# EAGLE design tx_no_transistor_adjustable_charging_current_hotswap (EAGLE 9.6.1)
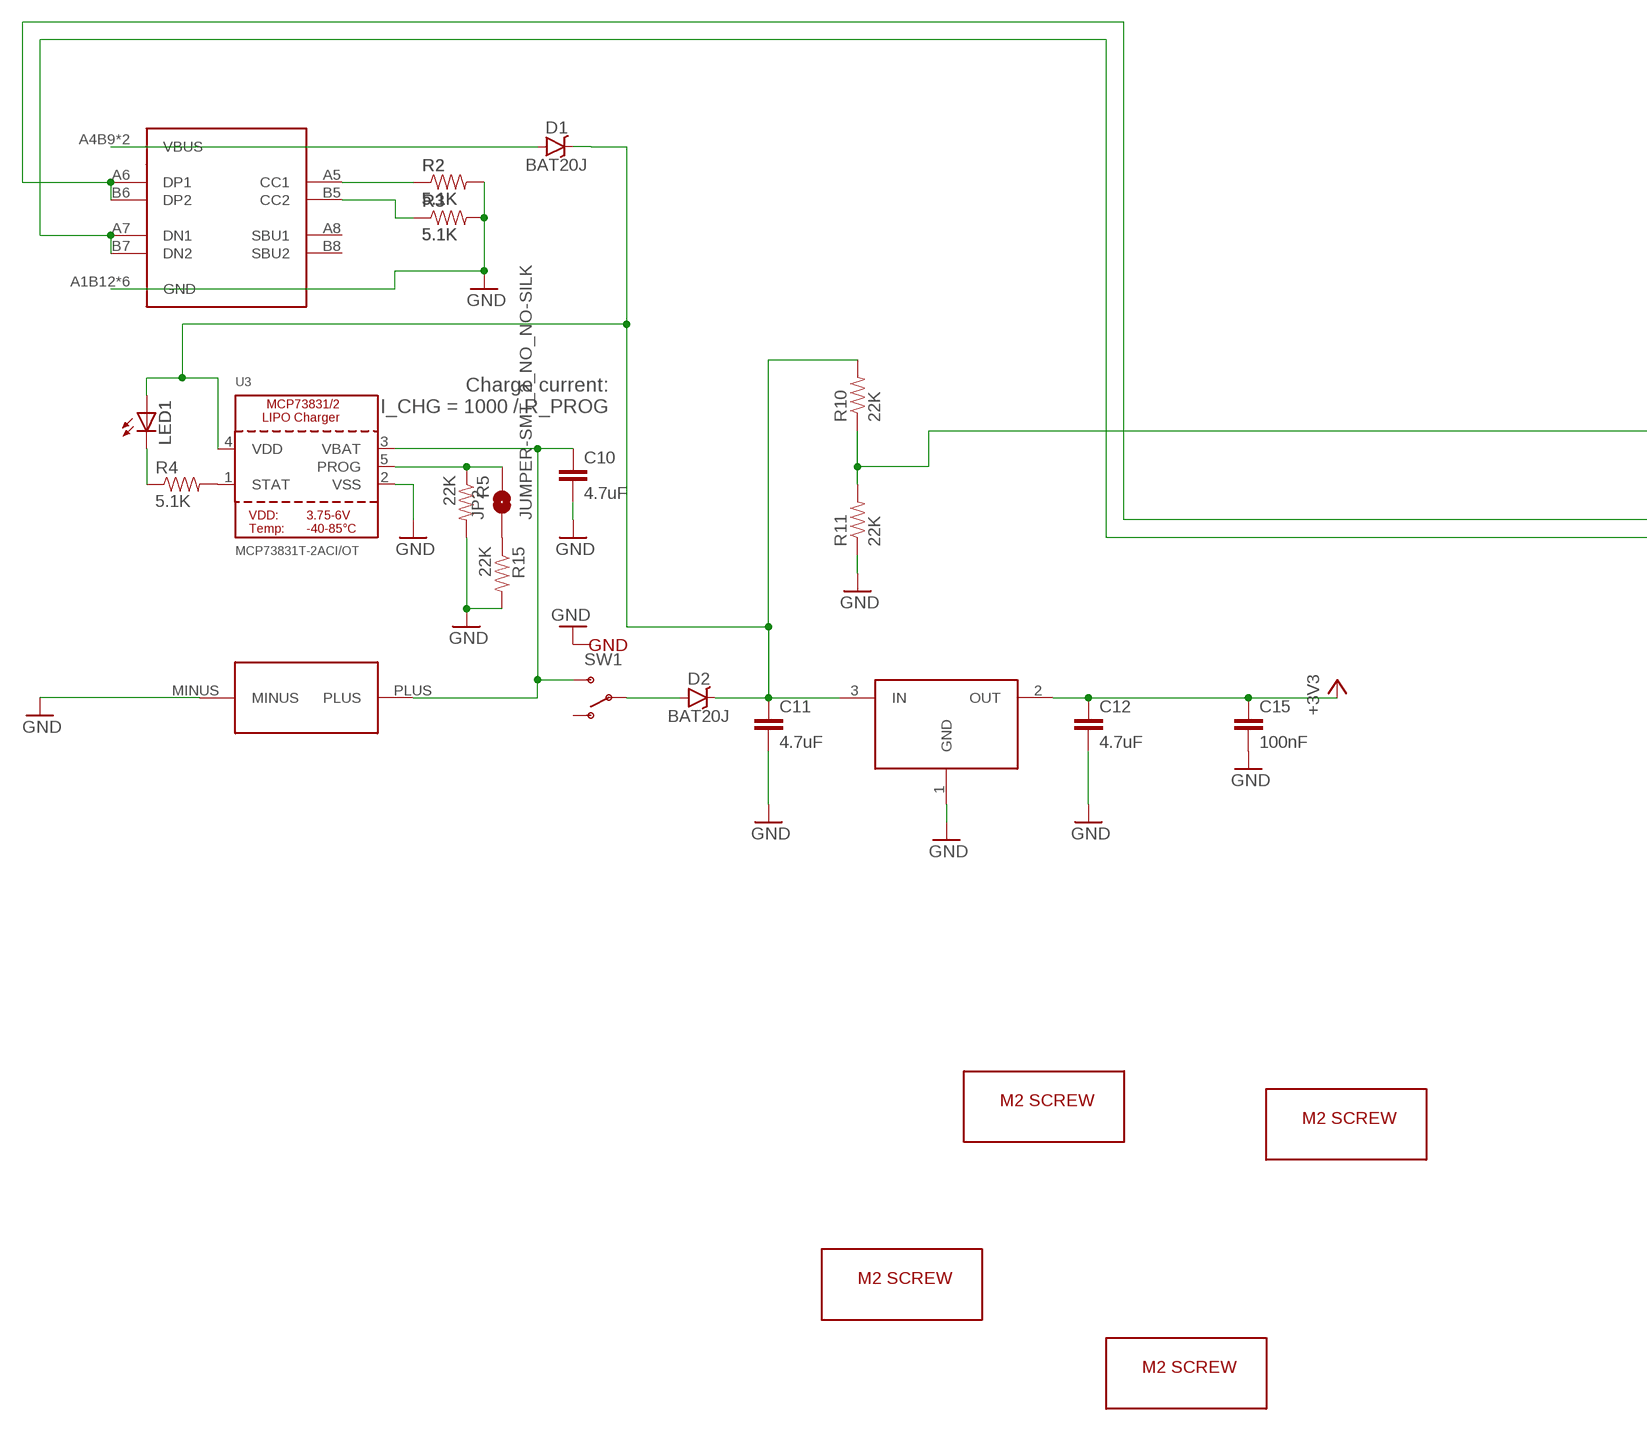
[diagram p0: schematic, sheet 1, part 1 of 2]
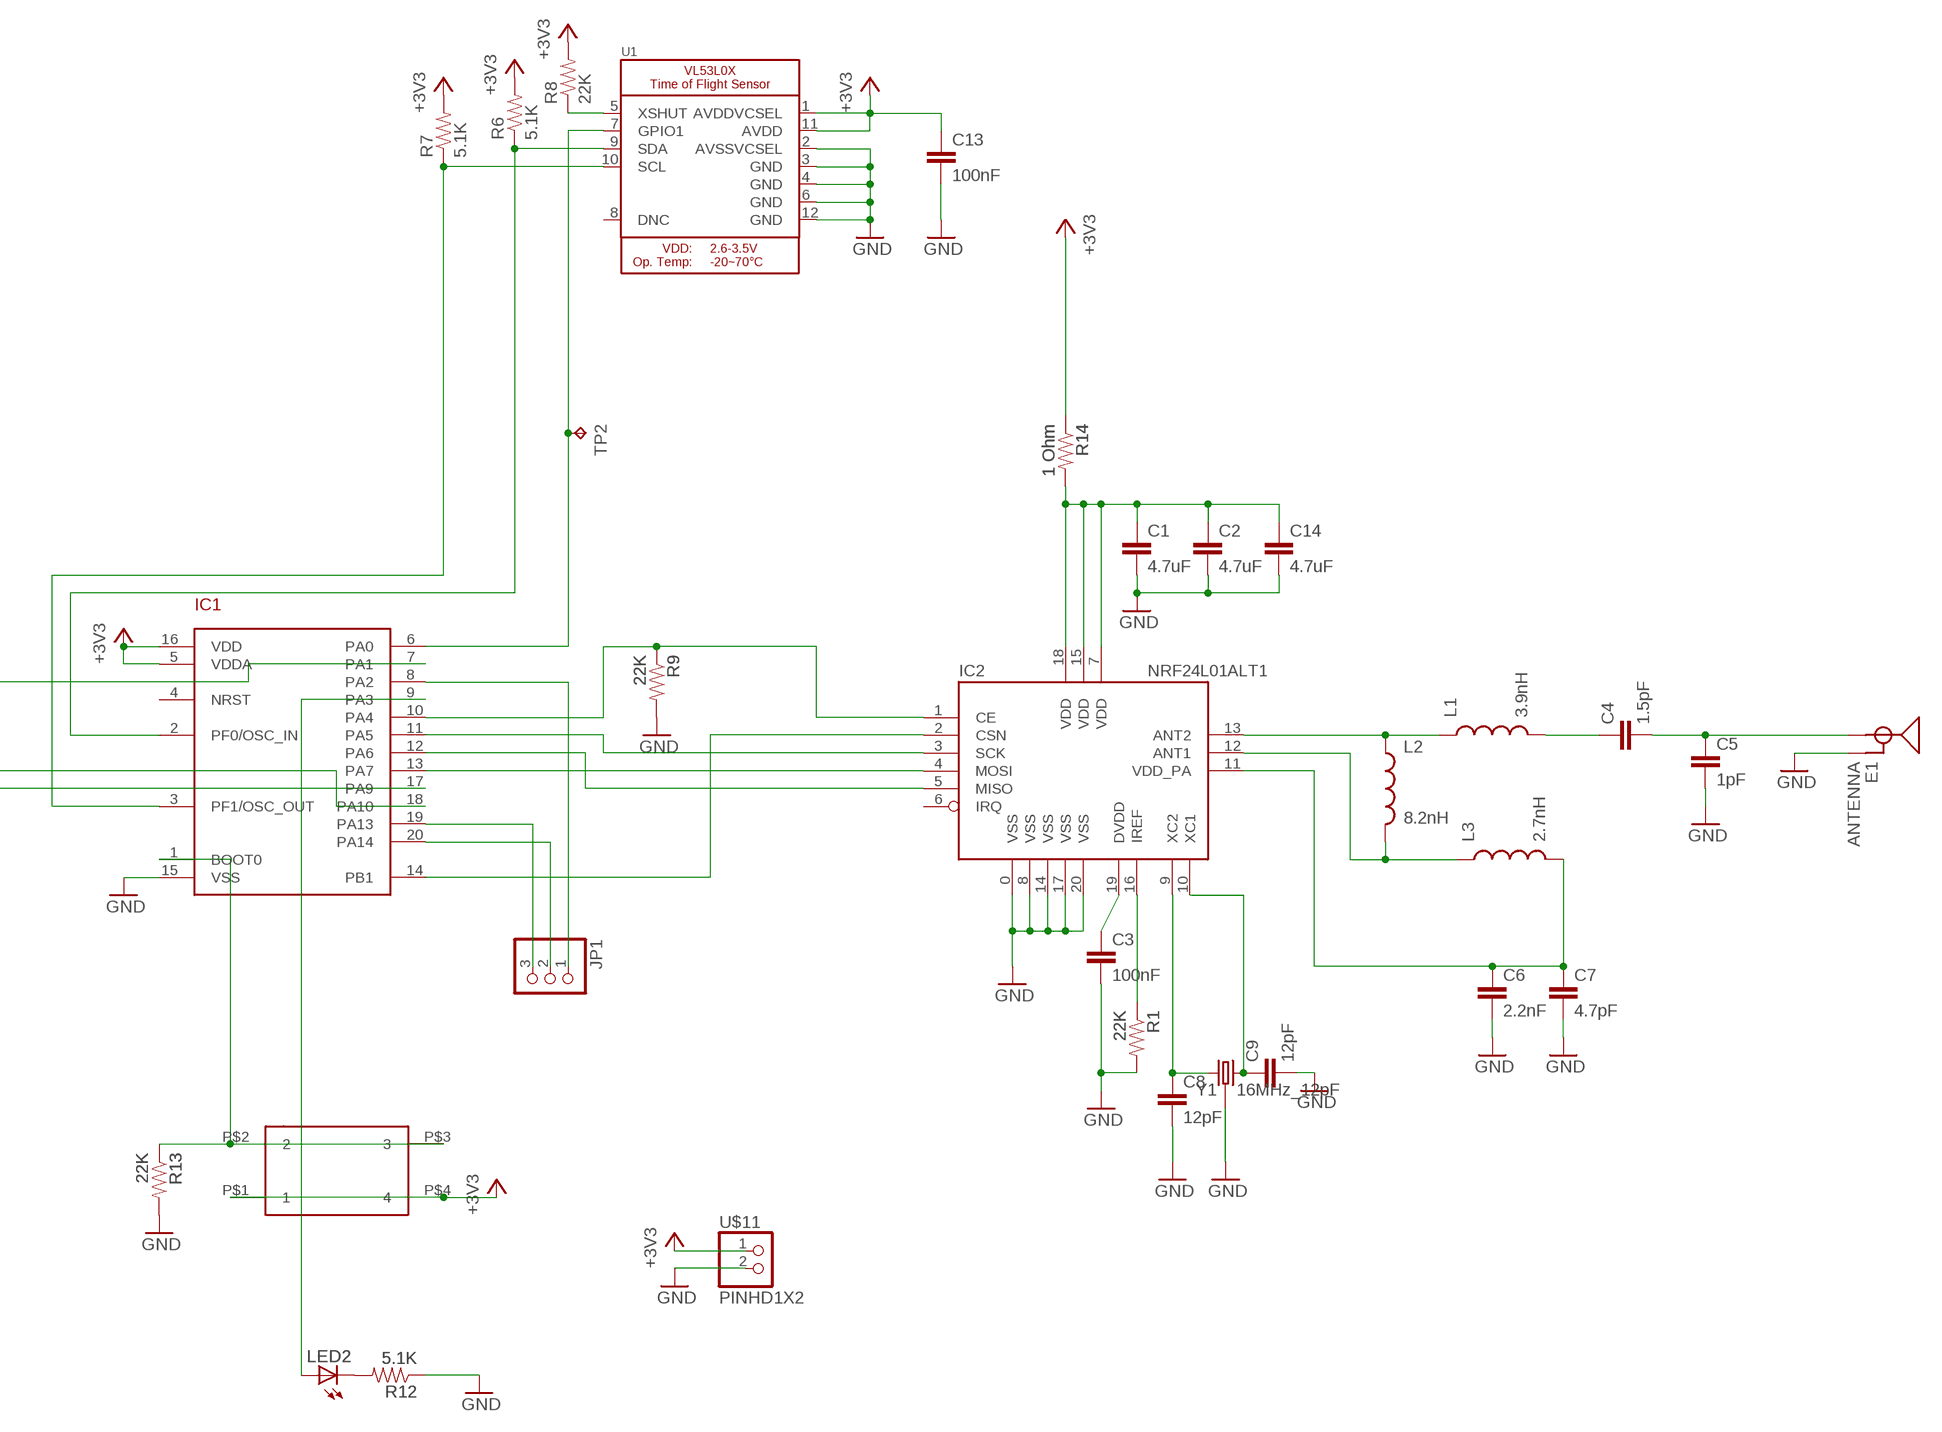
[diagram p1: schematic, sheet 1, part 2 of 2]

## Parts
C1  4.7uF  CAP0805  [0805]
C2  4.7uF  CAP0805  [0805]
C3  100nF  CAP0805  [0805]
C4  1.5pF  CAP0805  [0805]
C5  1pF  CAP0805  [0805]
C6  2.2nF  CAP0805  [0805]
C7  4.7pF  CAP0805  [0805]
C8  12pF  CAP0805  [0805]
C9  12pF  CAP0805  [0805]
C10  4.7uF  CAP0805  [0805]
C11  4.7uF  CAP0805  [0805]
C12  4.7uF  CAP0805  [0805]
C13  100nF  CAP0805  [0805]
C14  4.7uF  CAP0805  [0805]
C15  100nF  CAP0805  [0805]
D1  BAT20J  DIODE-SCHOTTKY-BAT20J  [SOD-323]
D2  BAT20J  DIODE-SCHOTTKY-BAT20J  [SOD-323]
E1  ANTENNA  ANTENNATRACE-TUNED  [TRACE_ANTENNA_2.4GHZ_25.7MM_TUNED]
IC1  STM32F030F4  [TSSOP20]
IC2  NRF24L01ALT1  [QFN20_ALT1]
JP1  PINHD-1X3CB  [1X03-CLEANBIG]
JP2  JUMPER-SMT_2_NO_NO-SILK  [SMT-JUMPER_2_NO_NO-SILK]
L1  3.9nH  INDUCTOR0805  [0805]
L2  8.2nH  INDUCTOR0805  [0805]
L3  2.7nH  INDUCTOR0805  [0805]
LED1  LEDCHIP-LED0805  [CHIP-LED0805]
LED2  LEDCHIP-LED0805  [CHIP-LED0805]
R1  22K  RESISTOR0805-RES  [0805]
R2  5.1K  RESISTOR0805-RES  [0805]
R3  5.1K  RESISTOR0805-RES  [0805]
R4  5.1K  RESISTOR0805-RES  [0805]
R5  22K  RESISTOR0805-RES  [0805]
R6  5.1K  RESISTOR0805-RES  [0805]
R7  5.1K  RESISTOR0805-RES  [0805]
R8  22K  RESISTOR0805-RES  [0805]
R9  22K  RESISTOR0805-RES  [0805]
R10  22K  RESISTOR0805-RES  [0805]
R11  22K  RESISTOR0805-RES  [0805]
R12  5.1K  RESISTOR0805-RES  [0805]
R13  22K  RESISTOR0805-RES  [0805]
R14  1 Ohm  RESISTOR0805-RES  [0805]
R15  22K  RESISTOR0805-RES  [0805]
SW1  SWITCH-SPDTTDFGDFG  [SWITCH-SPST-SMD-A]
SW2  324_SW324_SWITCH_FOOT_HOLE  [342_SWICH_FOOT_HOLE]
TP2  TPTP10R  [TP10R]
U1  VL53L0X  [LGA12_ST]
U2  USBC_16P  [USBC_16P_FOOT]
U3  MCP73831T-2ACI/OT  MCP73831/2  [SOT23-5]
U4  XC6206_DEV  [SOT23R_INFINEON]
U$1  M2_SCREW_DEV  [M2_SCREW_FOOT]
U$2  HOT_SWAP_COIN_BAT  [COIN_BAT_HOTSWAP_SOCKET]
U$11  PINHD1X2  [1X02]
U$12  M2_SCREW_DEV  [M2_SCREW_FOOT]
U$13  M2_SCREW_DEV  [M2_SCREW_FOOT]
U$14  M2_SCREW_DEV  [M2_SCREW_FOOT]
Y1  16MHz_12pF  CRYSTAL-26MHZSMD-3.2X2.5  [CRYSTAL-SMD-3.2X2.5MM]

## Nets
+3V3: C12.1 C13.1 C15.1 IC1.5(VDDA) IC1.16(VDD) R6.2 R7.2 R8.2 R14.1 SW2.P$1 SW2.P$4 U1.1(AVDDVCSEL) U1.11(AVDD) U4.2(OUT) U$11.1
GND: C1.2 C2.2 C3.2 C5.2 C6.2 C7.2 C8.2 C9.2 C10.2 C11.2 C12.2 C13.2 C14.2 C15.2 E1.GND E1.GND2(GND) IC1.15(VSS) IC2.0(VSS) IC2.8(VSS) IC2.14(VSS) IC2.17(VSS) IC2.20(VSS) R1.2 R2.2 R3.2 R5.2 R9.2 R11.1 R12.1 R13.2 R15.2 SW1.G1(GND) SW1.G2(GND) SW1.G3(GND) SW1.G4(GND) U1.2(AVSSVCSEL) U1.3(GND) U1.4(GND) U1.6(GND) U1.12(GND) U2.A1B12(GND) U2.B11A12(GND) U2.P$13(GND) U2.P$14(GND) U2.P$15(GND) U2.P$16(GND) U3.2(VSS) U4.1(GND) U$2.MINUS U$11.2 Y1.2 Y1.4
N$1: C3.1 IC2.19(DVDD)
N$2: IC2.16(IREF) R1.1
N$3: IC2.13(ANT2) L1.1 L2.1
N$4: C4.1 L1.2
N$5: C4.2 C5.1 E1.ANT(SIGNAL)
N$6: IC2.12(ANT1) L2.2 L3.1
N$7: C8.1 IC2.9(XC2) Y1.1
N$8: C6.1 C7.1 IC2.11(VDD_PA) L3.2
N$9: C9.1 IC2.10(XC1) Y1.3
N$10: R3.1 U2.B5(CC2)
N$11: R2.1 U2.A5(CC1)
N$12: LED1.C R4.1
N$13: R4.2 U3.1(STAT)
N$14: IC1.13(PA7) IC2.4(MOSI)
N$15: IC1.12(PA6) IC2.5(MISO)
N$16: IC1.11(PA5) IC2.3(SCK)
N$17: JP2.2 R5.1 U3.5(PROG)
N$18: IC1.18(PA10) U2.A6(DP1) U2.B6(DP2)
N$19: D2.A SW1.2(P)
N$20: IC1.14(PB1) IC2.2(CSN)
N$21: IC1.10(PA4) IC2.1(CE) R9.1
N$22: IC1.3(PF1/OSC_OUT) R7.1 U1.10(SCL)
N$23: IC1.2(PF0/OSC_IN) R6.1 U1.9(SDA)
N$24: R8.1 U1.5(XSHUT)
N$25: C10.1 SW1.3(S) U3.3(VBAT) U$2.PLUS
N$26: D1.A U2.A4B9(VBUS) U2.B4A9(VBUS)
N$27: C11.1 D1.C D2.C LED1.A R10.2 U3.4(VDD) U4.3(IN)
N$28: LED2.C R12.2
N$29: IC1.9(PA3) LED2.A
N$30: IC1.1(BOOT0) R13.1 SW2.P$2 SW2.P$3
N$31: IC1.19(PA13) JP1.3
N$32: IC1.20(PA14) JP1.2
N$33: IC1.8(PA2) JP1.1
N$34: IC1.17(PA9) U2.A7(DN1) U2.B7(DN2)
N$35: IC1.7(PA1) R10.1 R11.2
N$36: IC1.6(PA0) TP2.TP U1.7(GPIO1)
N$37: C1.1 C2.1 C14.1 IC2.7(VDD) IC2.15(VDD) IC2.18(VDD) R14.2
N$38: JP2.1 R15.1
Unconnected: IC1.4(NRST) IC2.6(IRQ) SW1.1(O) U1.8(DNC) U2.A8(SBU1) U2.B8(SBU2)

## Notes on the sheet
- Charge current:
  I_CHG = 1000 / R_PROG

## Library data of the parts
C1-C9 C11-C15 = clock:CAP: Capacitor Standard 0603 ceramic capacitor, and 0.1" leaded capacitor.
C10 = SparkFun-Passives:CAP: Capacitor Standard 0603 ceramic capacitor, and 0.1" leaded capacitor.
D1 D2 = SparkFun-DiscreteSemi:DIODE-SCHOTTKY: Schottky diodes in SFE's production catalog BAT20J 1A 23V 0.62Vf RB751 120mA 40V 0.37Vf PMEG4005EJ 0.5A 40V 0.42Vf MBRA140 1A 40V 0.5Vf B340A 3A 40V SMA; PROD_ID: DIO-11623
E1 = esp32-thing-temp:ANTENNA: Chip antenna Chip antenna with ground or secondary connection. Common with larger metal RF connectors.
IC1 = exixe_pogo:STM32F030F4
IC2 = nRF24L01-Chip-v13:NRF24L01: 2.4GHz Low Power Transceiver This is the very popular, low cost, very low power RF transceiver from Nordic Semiconductor. Simple SPI interface. SKU: COM-00690
JP1 = adafruit_changed:PINHD-1X3: PIN HEADER
JP2 = SparkFun-Jumpers:JUMPER-SMT_2_NO: Normally open jumper This jumper has two pads in close proximity to each other. Apply solder to close the connection. Round pads are easier to solder for beginners, but are a lot larger. SparkFun Product that uses the round pads: SparkFun EL Sequencer <https://www.sparkfun.com/products/12781>
L1-L3 = basicBoard:INDUCTOR: Inductors Basic Inductor/Choke - 0603 and 1206. Footprints are not proven and vary greatly between part numbers. INDUCTOR POWER 3.3UH 4.0A SMD 0.197" L x 0.197" W x 0.177" H (5.00mm x 5.00mm x 4.50mm)
LED1 LED2 = joyAnalog:LED: LED OSRAM: - CHIPLED LG R971, LG N971, LY N971, LG Q971, LY Q971, LO R971, LY R971 LH N974, LH R974 LS Q976, LO Q976, LY Q976 LO Q996 - Hyper CHIPLED LW Q18S LB Q993, LB Q99A, LB R99A - SideLED LS A670, LO A670, LY A670, LG A670, LP A670 LB A673, LV A673, LT A673, LW A673 LH A674 LY A675 LS A676, LA A676, LO A676, LY A676, LW A676 LS A679, LY A679, LG A679 - Hyper Micro SIDELED® LS Y876, LA Y876, LO Y876, LY Y876 LT Y87S - SmartLED LW L88C, LW L88S LB L89C, LB L89S, LG L890 LS L89K, LO L89K, LY L89K LS L896, LA L896, LO L896, LY L896 - TOPLED LS T670, LO T670, LY T670, LG T670, LP T670 LSG T670, LSP T670, LSY T670, LOP T670, LYG T670 LG T671, LOG T671, LSG T671 LB T673, LV T673, LT T673, LW T673 LH T674 LS T676, LA T676, LO T676, LY T676, LB T676, LH T676, LSB T676, LW T676 LB T67C, LV T67C, LT T67C, LS T67K, LO T67K, LY T67K, LW E67C LS E67B, LA E67B, LO E67B, LY E67B, LB E67C, LV E67C, LT E67C LW T67C LS T679, LY T679, LG T679 LS T770, LO T770, LY T770, LG T770, LP T770 LB T773, LV T773, LT T773, LW T773 LH T774 LS E675, LA E675, LY E675, LS T675 LS T776, LA T776, LO T776, LY T776, LB T776 LHGB T686 LT T68C, LB T68C - Hyper Mini TOPLED® LB M676 - Mini TOPLED Santana® LG M470 LS M47K, LO M47K, LY M47K Source: http://www.osram.convergy.de/
R1-R3 R9 R12-R14 = joyAnalog:RESISTOR: Resistor Basic schematic elements and footprints for 0603, 1206, and PTH resistors.
R4-R8 R10 R11 R15 = SparkFun-Passives:RESISTOR: Resistor Basic schematic elements and footprints for 0603, 1206, and PTH resistors.
SW1 = tx:SWITCH-SPDT: SPDT Switch Simple slide switch, Spark Fun Electronics SKU : COM-00102 DPDT SMT slide switch, AYZ0202, SWCH-08179
SW2 = 3pos_slide_switch:324_SW
TP2 = testpad:TP: Test pad
U1 = Adafruit VL53L0X:VL53L0X: VL53L0X - Laser Time of Flight Sensor (2M range)
U2 = my_usbc_16p:USBC_16P
U3 = microbuilder:MCP73831/2: MCP73831/2 LIPO Charger VDD: 3.75 - 6V Temp -40 - 85°C Programmable Charge Rate: 15-500mA NOTE: STAT is a tri-state logic output on the MCP73831 and an open-drain output on the MCP73832. SOT23-5 with 4.2V output and tri-state logic on STAT = MCP73831T-2ACI/OT
U4 = 3pos_slide_switch:XC6206_DEV
U$1 U$12-U$14 = 3pos_slide_switch:M2_SCREW_DEV
U$2 = 3pos_slide_switch_centered:HOT_SWAP_COIN_BAT
U$11 = adafruit_changed:PINHD1X2
Y1 = SparkFun-Clocks:CRYSTAL-26MHZ: 26MHz Crystal w/ Ground Pin Digikey Example <http://www.digikey.com/product-detail/en/epson/TSX-3225%2026.0000MF09Z-AC3/SER3627CT-ND/1802878> Frequency: 26MHz Frequency Stability: ±9ppm Frequency Tolerance: ±10ppm Load Capacitance: 9pF SparkFun Products: SparkFun ESP32 Thing <https://www.sparkfun.com/products/13907> SparkFun ESP8266 Thing Dev Board <https://www.sparkfun.com/products/13711>; PROD_ID: XTAL-12454

## Board
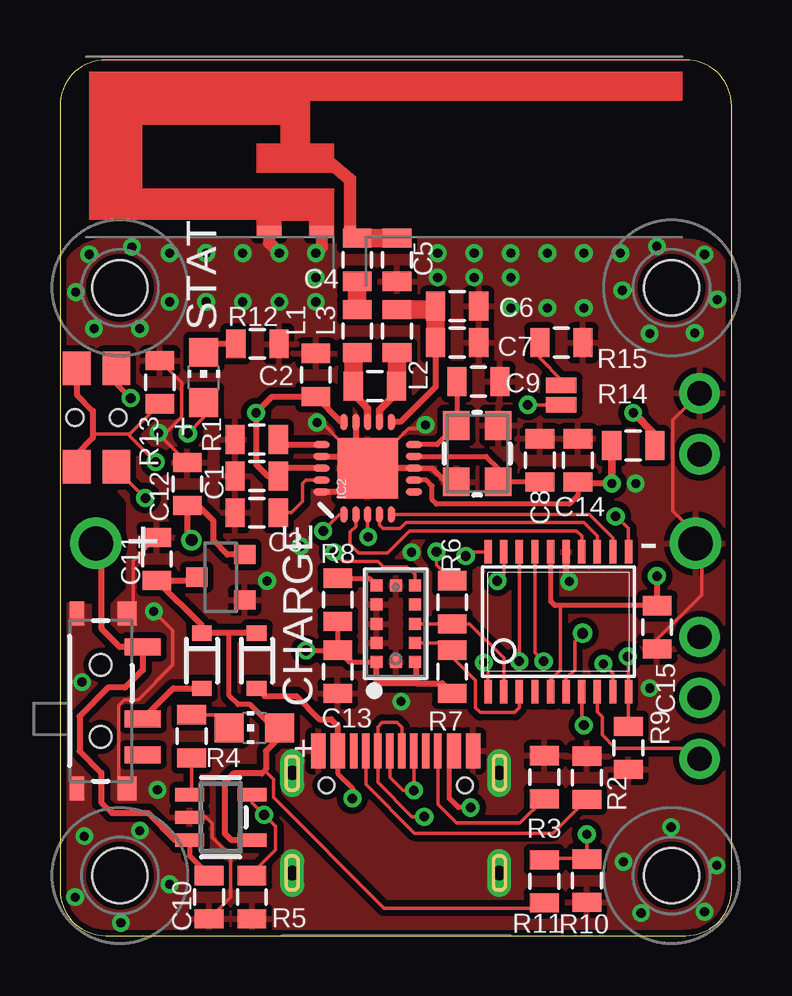
[diagram p2: board, top side]
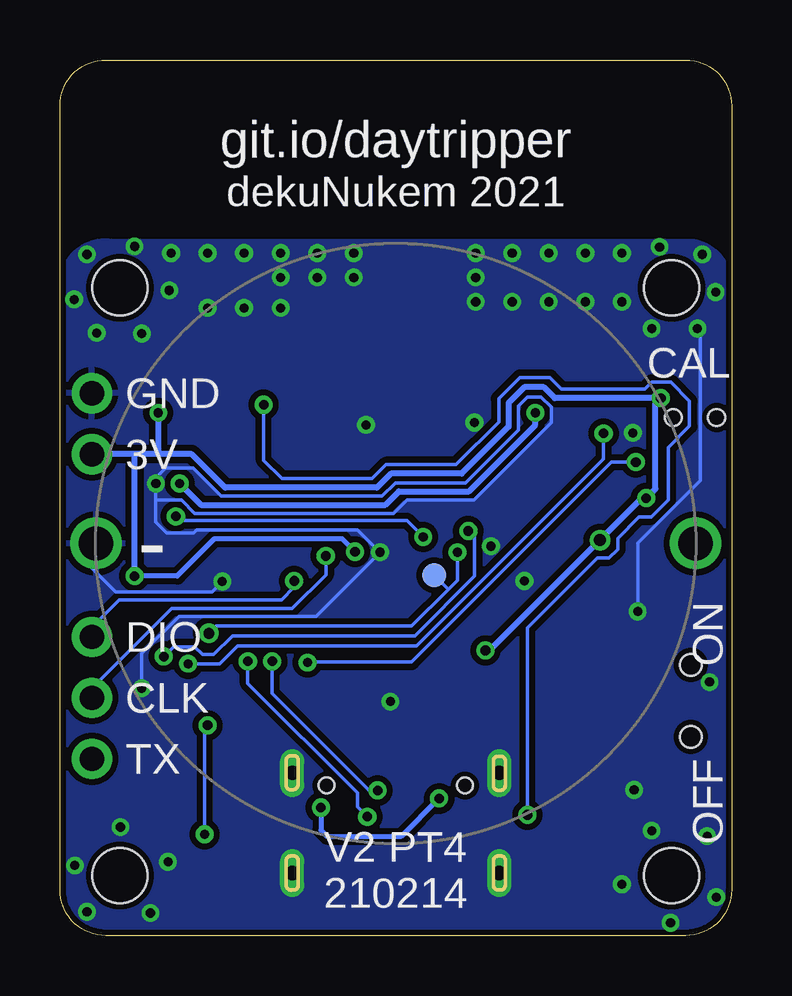
[diagram p3: board, bottom side, seen from below]

Size 28 x 36.5 mm. Coordinates in mm from the lower left corner, seen from the top.
Outline: 0,34.59 0,1.91 arc90 1.91,0 26.09,0 arc90 28,1.91 28,34.59 arc90 26.09,36.5 1.91,36.5 arc90 0,34.59
Copper layers (1*16): Top 0.035mm / dielectric 1.5mm / Bottom 0.035mm
Design rules "SparkFun-2-layer-6mil *": minimum track width 6mil, minimum drill 15mil, track to track 6mil, track to pad 6mil, pad to pad 6mil, via to via 6mil, smd to smd 6mil, copper to edge 8mil, drill to drill 6mil, minimum pad ring 7mil, minimum via ring 7mil, stop-mask expansion 4mil, vias tented up to drill 25mil, thermal gap 10mil
tRestrict: area 0.1,14.1 to 2.4,18.5

### Footprints (pad centres in the part's own frame; a part is rotated, then mirrored left to right if it is on the bottom)
0805 = smd 0.8 x 1.2: 1 -0.9,0; 2 0.9,0
SOD-323 = smd 0.63 x 0.83: A 1.15,0; C -1.15,0
TRACE_ANTENNA_2.4GHZ_25.7MM_TUNED = smd 0.46 x 0.46: ANT 0,0.23 | smd 1 x 0.46: GND -1.18,0.23; GND2 -3.38,0.23
TSSOP20 = smd 0.305 x 0.991: 1 -2.925,-2.918; 2 -2.275,-2.918; 3 -1.625,-2.918; 4 -0.975,-2.918; 5 -0.325,-2.918; 6 0.325,-2.918; 7 0.975,-2.918; 8 1.625,-2.918; 9 2.275,-2.918; 10 2.925,-2.918; 11 2.925,2.918; 12 2.275,2.918; 13 1.625,2.918; 14 0.975,2.918; 15 0.325,2.918; 16 -0.325,2.918; 17 -0.975,2.918; 18 -1.625,2.918; 19 -2.275,2.918; 20 -2.925,2.918
QFN20_ALT1 = smd 2.515 x 2.515: 0 0,0 | smd 0.686 x 0.293: 1 -1.925,0.986; 2 -1.925,0.493; 3 -1.925,0; 4 -1.925,-0.493; 5 -1.925,-0.986; 11 1.925,-0.986; 12 1.925,-0.493; 13 1.925,0; 14 1.925,0.493; 15 1.925,0.986 | smd 0.293 x 0.686: 6 -0.986,-1.925; 7 -0.493,-1.925; 8 0,-1.925; 9 0.493,-1.925; 10 0.986,-1.925; 16 0.986,1.925; 17 0.493,1.925; 18 0,1.925; 19 -0.493,1.925; 20 -0.986,1.925
1X03-CLEANBIG = drill 1.016 pad 1.676: 1 -2.54,0; 2 0,0; 3 2.54,0
SMT-JUMPER_2_NO_NO-SILK = smd 0.635 x 1.27: 1 -0.406,0; 2 0.406,0
CHIP-LED0805 = smd 1.2 x 1.2: A 0,-1.05; C 0,1.05
SWITCH-SPST-SMD-A = smd 0.7 x 1.5: 1 -2.25,-1.75; 2 -0.75,-1.75; 3 2.25,-1.75 | smd 1 x 0.6: G1 -3.65,1; G3 3.65,1 | smd 1 x 0.8: G2 -3.65,-1.1; G4 3.65,-1.1 | hole 0.9: -1.5,0; 1.5,0
342_SWICH_FOOT_HOLE = smd 1.4 x 1.15: P$1 -2.05,-0.825; P$2 -2.05,0.825; P$3 2.05,0.825; P$4 2.05,-0.825 | hole 0.7: 0,0.9; 0,-0.9
TP10R = smd 1 x 1: TP 0,0
LGA12_ST = smd 0.5 x 0.5: 1 1.6,-0.8; 2 0.8,-0.8; 3 0,-0.8; 4 -0.8,-0.8; 5 -1.6,-0.8; 6 -1.6,0; 7 -1.6,0.8; 8 -0.8,0.8; 9 0,0.8; 10 0.8,0.8; 11 1.6,0.8; 12 1.6,0
USBC_16P_FOOT = smd 0.6 x 1.45: A1B12 -3.225,3.848; A4B9 -2.425,3.848; B4A9 2.425,3.848; B11A12 3.225,3.848 | smd 0.3 x 1.45: A5 -1.25,3.848; A6 -0.25,3.848; A7 0.25,3.848; A8 1.25,3.848; B5 1.75,3.848; B6 0.75,3.848; B7 -0.75,3.848; B8 -1.75,3.848 | drill 0.6 pad 1 long: P$13 -4.32,2.933; P$14 4.32,2.933; P$15 -4.32,-1.248; P$16 4.32,-1.248 | hole 0.65: -2.89,2.402; 2.89,2.402
SOT23-5 = smd 0.55 x 1.2: 1 -0.95,-1.3; 2 0,-1.3; 3 0.95,-1.3; 4 0.95,1.3; 5 -0.95,1.3
SOT23R_INFINEON = smd 0.8 x 0.9: 1 -0.95,-1; 2 0.95,-1; 3 0,1
M2_SCREW_FOOT = hole 2.3: 0,0
COIN_BAT_HOTSWAP_SOCKET = drill 1.43 pad 2: MINUS 12.5,0; PLUS -12.5,0
1X02 = drill 1.016 pad 1.676: 1 -1.27,0; 2 1.27,0
CRYSTAL-SMD-3.2X2.5MM = smd 1.2 x 1.1: 1 -1.175,-0.875; 2 1.175,-0.875; 3 1.175,0.875; 4 -1.175,0.875

### Placement (x,y rotation side)
C1  8.2,19.15 180 top
C2  10.67,23.37 90 top
C3  8.2,17.63 180 top
C4  12.4,28.17 90 top
C5  14.05,28.17 270 top
C6  16.56,26.24 0 top
C7  16.56,24.71 0 top
C8  20.02,19.81 90 top
C9  17.45,23.09 0 top
C10  6.22,1.6 270 top
C11  4.04,15.7 90 top
C12  5.31,18.82 90 top
C13  11.58,11 270 top
C14  21.59,19.81 90 top
C15  24.89,12.85 270 top
D1  8.2,11.46 270 top
D2  5.92,11.46 270 top
E1  12.09,29.11 0 top
IC1  20.78,13.08 0 top
IC2  12.83,19.48 90 top
JP1  26.67,9.91 90 top
JP2  20.9,22.53 270 top
L1  12.4,25.2 90 top
L2  13.13,22.91 0 top
L3  14.05,25.2 90 top
LED1  8.1,8.66 90 top
LED2  5.99,23.27 0 top
R1  8.2,20.68 180 top
R2  21.97,6.58 90 top
R3  20.19,6.6 90 top
R4  5.49,8.31 270 top
R5  8,1.6 270 top
R6  16.36,13.89 90 top
R7  16.36,11 270 top
R8  11.58,14 270 top
R9  23.7,7.82 270 top
R10  20.19,2.26 270 top
R11  21.97,2.29 90 top
R12  8.23,24.66 180 top
R13  4.17,23.06 90 top
R14  23.9,20.42 180 top
R15  20.9,24.71 0 top
SW1  1.7,9.78 90 top
SW2  1.52,21.59 90 top
TP2  12.4,15.01 0 bottom
U1  14,13 270 top
U2  14,3.85 0 top
U3  6.71,4.93 270 top
U4  6.71,14.94 90 top
U$1  2.5,2.5 0 top
U$2  14,16.35 0 top
U$11  26.67,21.34 90 top
U$12  25.5,2.5 0 top
U$13  2.5,27 0 top
U$14  25.5,27 0 top
Y1  17.4,20.09 90 top

### Tracks (layer width: path | path; a pad name or v marks a point on that pad's centre or on a via)
+3V3  (via drill 0.38, 0.4, 0.5)
  Top 0.152: R6.2 15.7,15.45 v15.7,16 | IC1.5 20.45,10.65 20.87,11.06 20.87,13.74 | SW2.P$1 2.35,19.44 v3.56,18.24
  Top 0.203: R8.2 C13.1 | C13.1 12.08,11.4 U1.1 | v10.26,11.89 11.57,11.89 C13.1 | IC1.16 20.45,13.94 20.64,13.75 20.88,13.75 | C15.1 20.88,13.75 | 20.87,13.74 20.88,13.75 | v2.95,22.4 2.35,23 SW2.P$4
  Top 0.254: U1.1 13.2,10.52 14.85,10.52 | 14.85,10.52 14.85,11.35 U1.11 | 14.85,10.52 15.94,10.52 R7.2 | v24.89,14.99 C15.1 | U4.2 6.97,15.88 6.4,16.46 6.4,17.27 5.75,17.92 C12.1 5.31,16.66 v5.49,16.48
  Top 0.305: R14.1 24.8,20.89 v23.9,21.79
  Bottom 0.203: v15.7,16 16.23,16.54 21.57,16.54 23.11,14.99 v24.89,14.99
  Bottom 0.254: v10.26,11.89 10.08,11.89 v5.49,16.48 3.73,18.24 v3.56,18.24 3.17,18.62 3.17,22.17 v2.95,22.4 7.37,22.4 7.82,22.86 8.64,22.86 9.3,22.2 9.3,21.21 11.25,19.25 14.2,19.25 14.78,18.67 21.11,18.67 22.5,20.07 23.9,20.07 | 23.9,20.07 24.92,20.07 | 24.92,20.07 U$11.1 | v23.9,21.79 23.9,20.07 | v24.89,14.99 24.89,20.04 24.92,20.07
GND  (via drill 0.38)
  Top 0.152: IC2.0 12.33,19.98 | C15.2 24.89,12.34 26.75,14.21 26.75,16.09 U$2.MINUS 26.5,16.76 25.55,17.7 25.55,21.49 U$11.2 | v10.72,21.39 10.92,21.39 11.68,20.62 12.33,20.62 | v15.24,21.29 15.09,21.13 14.53,21.13 13.92,20.52 12.38,20.52 12.33,20.57 | U3.2 6.1,4.93 6.35,4.67 6.35,4.09 7.11,3.33 7.11,1.59 C10.2 | SW1.G2 2.44,6.49 2.44,9.6 2.67,9.83 3.25,9.83 4.7,11.28 4.7,12.72 v3.91,13.51 | C11.2 3.05,15.61 3.05,13.68 SW1.G4 | C12.2 4.25,20.78 | 4.25,20.78 4.12,20.91 v4.12,20.95 | R13.2 5.08,23.05 5.08,21.61 4.25,20.78
  Top 0.203: IC2.8 15.52,19.48 16.09,18.92 Y1.4
  Top 0.254: IC2.17 11.79,19.98 | IC2.20 11.79,18.5 11.79,19.98 | IC2.14 12.33,20.62 12.33,20.57 12.33,19.98 11.79,19.98 | IC2.8 IC2.0 | IC1.15 21.1,14.89 v21.23,14.76
  Top 0.508: E1.GND2 8.71,28.88 v9.14,28.45 | E1.GND 10.91,28.69 v10.67,28.45
  Bottom 0.152: v24.59,10.31 24.59,11.76 23.04,13.31 17.32,13.31 v14.66,15.98 15.6,16.92 22.3,16.92 22.43,16.79 23.55,16.79 24,17.25 24,18.16 | 24,18.16 v24,18.85 24,19.07 23.6,19.48 22.45,19.48 21.29,18.31 14.58,18.31 14.02,18.87 11.1,18.87 8.89,21.08 8.89,22.07 8.51,22.45 7.95,22.45 7.52,22.02 7.52,21.39 10.74,18.16 13.54,18.16 14.1,17.6 22.38,17.6 22.94,18.16 24,18.16 | v21.23,14.76 21.67,14.33 25.68,14.33 26.75,15.4 | v3.91,13.51 3.91,16.36 1.29,18.97 1.29,25.17 v1.42,25.3
  other vias: 15.75,28.45 15.75,27.43 17.27,28.45 18.8,28.45 20.32,28.45 21.84,28.45 23.37,28.45 7.62,28.45 6.1,28.45 4.57,28.45 10.67,26.42 0.91,10.57 4.06,6.07 1.02,4.14 8.64,14.78 27.38,2.92 14.22,9.75 1.22,28.4 0.66,26.82 3,28.7 24.89,28.73 26.87,28.4 27.41,26.52 26.47,25.12 6.1,26.42 7.62,26.42 9.14,26.42 17.27,27.43 18.8,26.16 20.32,26.16 21.84,26.16 23.44,26.9 24.59,25.1 18.8,27.43 3.33,25.3 4.57,26.42 10.03,16.23 0.64,1.6 2.54,0.53 3.33,4.37 4.57,2.13 25.48,4.52 23.5,3.07 24.23,0.94 26.87,0.99 10.67,27.43
  pour Top (isolate 0.254): 0,27.09 0,1.91 arc90 1.91,0 26.09,0 arc90 28,1.91 28,27.09 arc90 26.09,29 1.91,29 arc90
  pour Bottom (isolate 0.254): 0,27.09 0,1.91 arc90 1.91,0 26.09,0 arc90 28,1.91 28,27.09 arc90 26.09,29 1.91,29 arc90
N$1
  Top 0.152: IC2.19 10.25,18.99 10.11,18.85 10.11,18.09 9.65,17.63 C3.1
N$2
  Top 0.254: R1.1 9.31,20.47 IC2.16
N$3
  Top 0.254: 12.23,22.57 L2.1
  Top 0.305: IC2.13 12.83,21.97 12.65,22.15 12.23,22.57
  Top 0.61: 12.23,24.13 L1.1
  Top 0.762: L2.1 12.23,24.13
N$4
  Top 0.762: L1.2 C4.1
N$5
  Top 0.508: E1.ANT 12.12,29.34 C4.2
  Top 0.762: C5.1 C4.2
N$6
  Top 0.254: 14.03,22.62 L2.2
  Top 0.305: IC2.12 13.32,21.91 14.03,22.62
  Top 0.61: L2.2 14.05,22.93
  Top 0.762: 14.05,22.93 L3.1
N$7
  Top 0.203: IC2.9 17.77,19.98 18.27,19.47 Y1.1 C8.1
N$8
  Top 0.254: IC2.11 14.19,21.41 15.66,22.87 C7.1
  Top 0.762: L3.2 15.52,26.1 | 15.52,26.1 C6.1 | C7.1 15.66,25.95 15.52,26.1
N$9
  Top 0.203: IC2.10 15.73,20.47 Y1.3 16.55,21.29 C9.1
N$10
  Top 0.152: R3.1 19.18,4.69 16.52,4.69 15.75,5.46 U2.B5
N$11
  Top 0.152: R2.1 20.56,4.27 14.78,4.27 12.75,6.3 U2.A5
N$12
  Top 0.152: R4.1 6.51,9.21 LED1.C
N$13
  Top 0.152: U3.1 5.49,5.96 R4.2
N$14
  Top 0.152: IC2.4 13.32,17.11 13.46,16.97 14.17,16.97 14.43,17.22 21.84,17.22 22.4,16.66 IC1.13
N$15
  Top 0.152: IC2.5 22.07,17.56 23.05,16.57 IC1.12
N$16  (via drill 0.38, 0.4)
  Top 0.152: IC2.3 12.83,16.64 v12.85,16.61 | v23.16,17.48 23.19,17.48 23.7,16.96 IC1.11
  Bottom 0.152: v23.16,17.48 22.99,17.3 13.54,17.3 v12.85,16.61
N$17  (via drill 0.4)
  Top 0.152: R5.1 8,2.59 8.99,3.58 8.99,4.55 v8.51,5.03 8.01,5.53 U3.5 | v19.51,22.12 JP2.2
  Bottom 0.152: v8.51,5.03 8.51,12.83 5.59,15.75 5.11,15.75 4.75,16.1 4.75,16.56 3.86,17.45 3.35,17.45 2.64,18.16 2.64,20.34 1.75,21.23 1.75,22.28 2.54,23.06 3.33,23.06 3.61,22.78 7.09,22.78 7.57,23.27 8.81,23.27 9.7,22.38 9.7,21.41 11.48,19.63 14.4,19.63 14.99,19.05 18.75,19.05 19.51,19.81 v19.51,22.12
N$18  (via drill 0.4)
  Top 0.152: IC1.18 v19.15,11.43 | U2.A6 13.75,6.59 14.3,6.04 v14.76,6.04 v14.75,6.05 U2.B6
  Bottom 0.152: v19.15,11.43 19.15,10.08 15.11,6.04 v14.76,6.04
N$19
  Top 0.254: SW1.2 4.73,10.3 D2.A
N$20
  Top 0.152: IC2.2 12.33,17.06 12.09,16.82 12.09,16.31 12.45,15.95 13.66,15.95 14.58,16.87 21.54,16.87 21.75,16.65 IC1.14
N$21  (via drill 0.4)
  Top 0.152: v23.67,11.63 23.7,11.6 IC1.10 R9.1 | IC2.1 11.66,17.56 v10.97,16.87
  Bottom 0.152: v10.97,16.87 10.72,16.61 10.72,14.99 13.21,12.5 20.8,12.5 21.59,11.71 22.05,11.71 22.38,12.04 23.27,12.04 v23.67,11.63
N$22
  Top 0.152: U1.10 16.06,12.2 R7.1 16.36,11.59 17.32,10.63 17.32,9.5 17.53,9.3 18.95,9.3 19.15,9.5 IC1.3
N$23
  Top 0.152: IC1.2 18.5,11.57 17.08,12.99 R6.1 U1.9
N$24
  Top 0.203: R8.1 12.9,14.89 U1.5
N$25
  Top 0.203: U3.3 5.41,3.32 C10.1
  Top 0.254: U3.3 4.81,3.98 3.68,5.11 2.16,5.11 1.73,5.54 1.73,6.78 0.81,7.7 0.81,9.14 2.01,10.34 2.72,10.34 3.45,11.07 SW1.3 2.5,12.03 1.73,12.8 1.73,16.12 U$2.PLUS
N$26  (via drill 0.4)
  Top 0.203: v12.19,5.71 12.19,6.15 11.57,6.76 U2.A4B9 | v17.12,5.33 16.61,5.33 16.23,5.71 16.23,7.5 U2.B4A9
  Top 0.254: D1.A 8.53,9.98 9.86,9.98 10.82,9.02 11.3,9.02 11.57,8.74 U2.A4B9
  Bottom 0.203: v12.19,5.71 13.77,4.14 16.87,4.14 17.12,4.39 v17.12,5.33
N$27
  Top 0.152: R10.2 19.98,1.14 13.51,1.14 8.9,5.75 8.9,6.51 8.59,6.83 8.59,6.93
  Top 0.203: 7.06,12.61 7.06,9.98 7.42,9.63 7.93,9.63 8.9,8.66 LED1.A
  Top 0.254: D1.C 7.06,12.61 7.01,12.61 D2.C 5.92,12.92 C11.1 5.57,14.8 | 5.57,14.8 U4.3 5.57,14.8 | U3.4 7.15,3.98 6.88,4.24 6.88,6.4 7.24,6.76 8.41,6.76 8.59,6.93 8.59,7.7 9.15,8.26 LED1.A
N$28
  Top 0.254: R12.2 6.34,24.66 LED2.C
N$29  (via drill 0.38, 0.4)
  Top 0.152: IC1.9 23.05,10.93 v22.66,11.33 | LED2.A 5.99,21.59 v5.33,20.93
  Bottom 0.152: v5.33,20.93 5.33,19.86 13.13,12.06 20.6,12.06 21.34,11.33 v22.66,11.33
N$30  (via drill 0.38, 0.4)
  Top 0.152: v17.68,11.38 17.85,11.21 IC1.1 | R13.1 2.91,20.9 | 2.91,20.9 1.37,20.9 | v3.99,19.74 2.91,20.82 2.91,20.9
  Top 0.254: SW2.P$3 0.7,22.54 1.37,21.87 1.37,20.9 1.37,20.75 0.7,20.08 SW2.P$2
  Bottom 0.152: v17.68,11.38 17.65,11.4 13.34,11.4 5,19.74 v3.99,19.74
N$31  (via drill 0.4)
  Top 0.152: IC1.19 18.5,15.05 v18.24,14.78
  Bottom 0.152: v18.24,14.78 18.24,14.53 18.77,13.99 25.53,13.99 26.67,12.85 JP1.3
N$32  (via drill 0.4)
  Top 0.152: IC1.20 17.09,16 v16.92,15.82
  Bottom 0.152: v16.92,15.82 16.92,15.04 18.31,13.64 23.34,13.64 26.67,10.31 JP1.2
N$33
  Top 0.152: JP1.1 26.24,7.8 23.16,7.8 22.61,8.36 22.61,9.12 22.4,9.32 IC1.8
N$34  (via drill 0.4)
  Top 0.152: IC1.17 19.8,11.79 v20.17,11.43 | v15.19,4.95 14.68,4.95 13.25,6.38 U2.B7 13.25,8.7 13.44,8.89 14.05,8.89 14.25,8.69 U2.A7
  Bottom 0.152: v15.19,4.95 15.6,5.36 15.6,5.94 20.17,10.52 v20.17,11.43
N$35  (via drill 0.38, 0.4)
  Top 0.152: IC1.7 21.75,8.86 v21.84,8.76 | v21.97,4.22 21.97,3.23 | 21.97,3.23 R11.2 | R10.1 20.26,3.23 21.97,3.23
  Bottom 0.152: v21.97,4.22 21.97,8.64 v21.84,8.76
N$36  (via drill 0.38, 0.45)
  Top 0.152: IC1.6 21.1,10.71 21.46,11.07 21.46,12.27 v21.79,12.6 | U1.7 14.8,15.04 14.48,15.37 13.49,15.37 13.26,15.6 11.81,15.6 v11.43,15.98
  Bottom 0.152: v21.79,12.6 21.49,12.9 13.34,12.9 11.81,14.43 | v11.43,15.98 11.43,14.81 11.81,14.43 | TP2.TP 11.81,14.43
N$37  (via drill 0.38)
  Top 0.203: IC2.7 15.28,18.99 15.52,18.75 15.52,18.16 15.7,17.98 21.23,17.98 21.59,18.34 C14.1
  Top 0.254: IC2.18 9.43,19.48 C1.1 8.66,19.15 8.18,19.63 v8.18,21.79 8.85,22.47 C2.1 11.73,21.41 IC2.15 | C14.1 21.66,18.85 v23.01,18.85 v23,18.86
  Top 0.305: R14.2 v23,18.86
  Bottom 0.254: v23.01,18.85 22.12,17.96 14.43,17.96 13.87,18.52 10.95,18.52 8.18,21.29 v8.18,21.79
N$38
  Top 0.152: JP2.1 20.9,23.16 20,24.07 R15.1

### Text on the board
tNames: STAT | CHARGE
bNames: git.io/daytripper | dekuNukem 2021 | CAL | GND | 3V | - | ON | DIO | CLK | OFF | TX | V2 PT4 / 210214